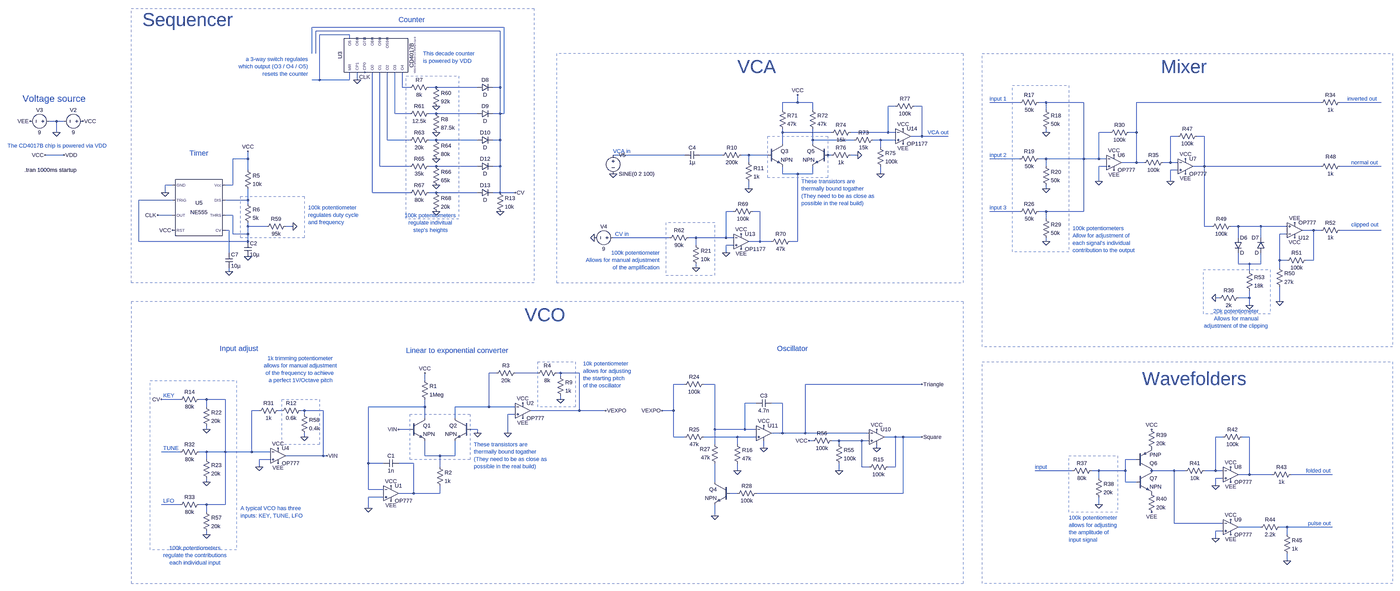
[diagram p0: schematic Full Simulation.asc, whole sheet]
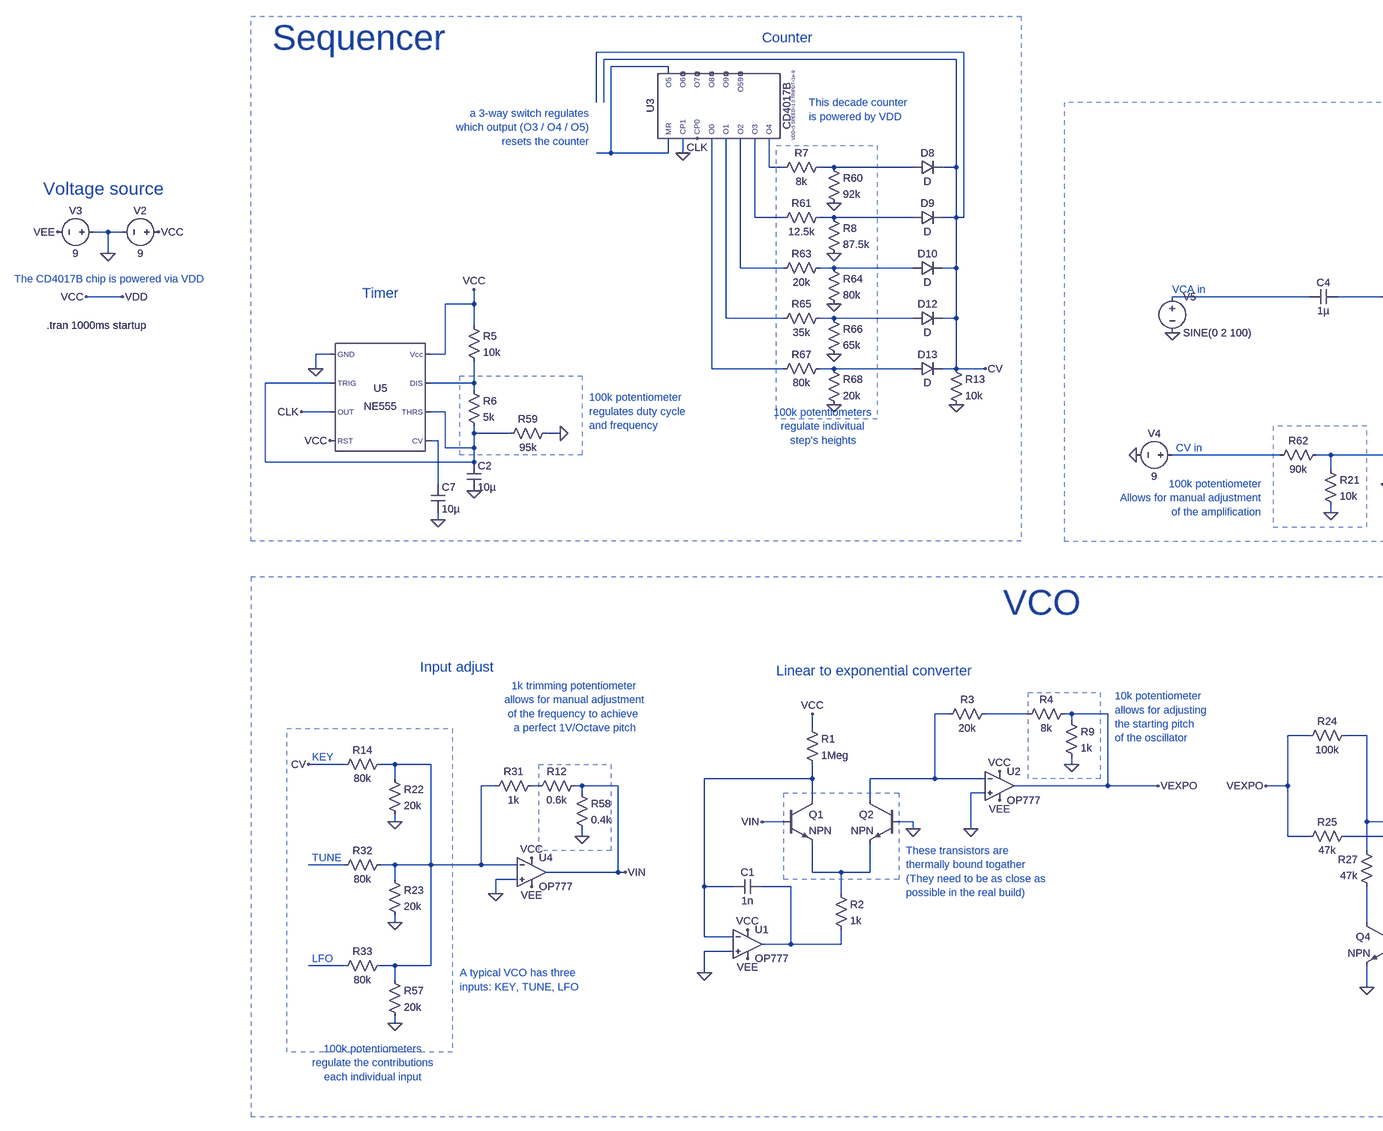
[diagram p1: schematic Full Simulation.asc, part, row 1 of 1, column 1 of 2]
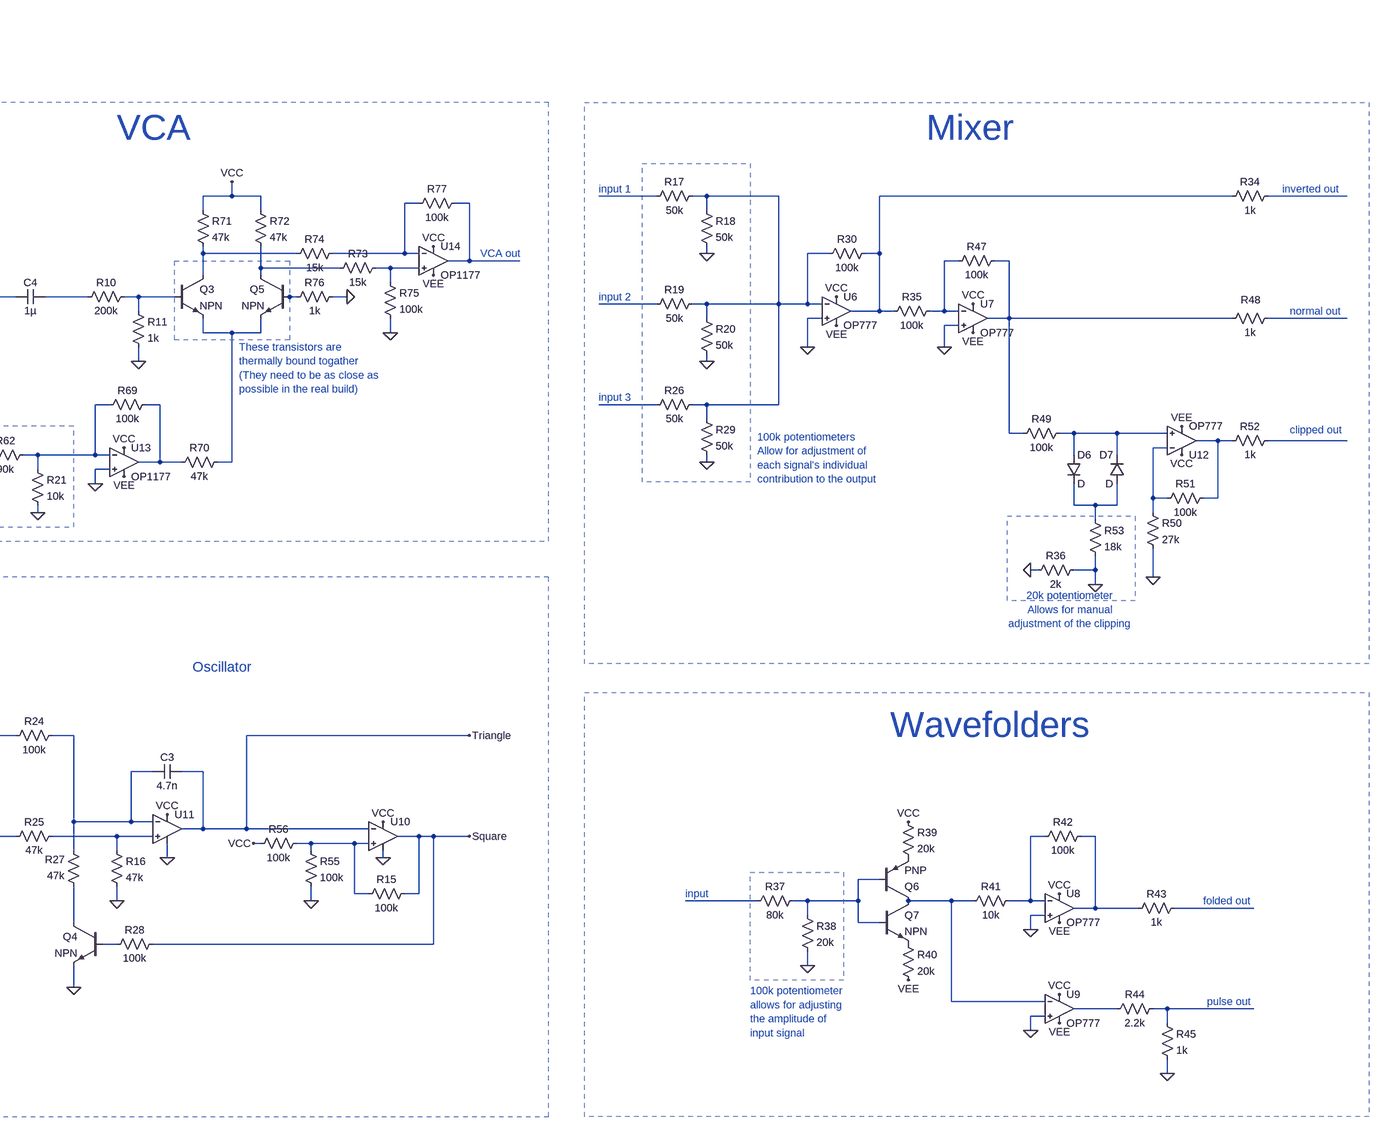
[diagram p2: schematic Full Simulation.asc, part, row 1 of 1, column 2 of 2]
Full Simulation.asc, the LTspice schematic file:
Version 4.1
SHEET 1 4816 2180
WIRE -1136 -736 -1952 -736
WIRE -1152 -720 -1936 -720
WIRE -1792 -704 -1920 -704
WIRE -1792 -688 -1792 -704
WIRE -1952 -624 -1952 -736
WIRE -1936 -624 -1936 -720
WIRE -1920 -512 -1920 -704
WIRE -1920 -512 -1952 -512
WIRE -1792 -512 -1792 -544
WIRE -1792 -512 -1920 -512
WIRE -1760 -512 -1760 -544
WIRE -1568 -480 -1568 -544
WIRE -1536 -480 -1568 -480
WIRE -1424 -480 -1456 -480
WIRE -1248 -480 -1424 -480
WIRE -1152 -480 -1152 -720
WIRE -1152 -480 -1184 -480
WIRE 112 -416 112 -448
WIRE 112 -416 48 -416
WIRE 176 -416 112 -416
WIRE 1056 -416 928 -416
WIRE 1168 -416 1136 -416
WIRE 1328 -416 1168 -416
WIRE 2336 -416 1552 -416
WIRE 2592 -416 2416 -416
WIRE 528 -400 496 -400
WIRE 640 -400 608 -400
WIRE 48 -384 48 -416
WIRE 176 -384 176 -416
WIRE 1168 -384 1168 -416
WIRE -1600 -368 -1600 -544
WIRE -1536 -368 -1600 -368
WIRE -1424 -368 -1456 -368
WIRE -1248 -368 -1424 -368
WIRE -1152 -368 -1152 -480
WIRE -1152 -368 -1184 -368
WIRE -1136 -368 -1136 -736
WIRE -1136 -368 -1152 -368
WIRE -3376 -336 -3408 -336
WIRE -3344 -336 -3376 -336
WIRE -3376 -288 -3376 -336
WIRE 48 -288 48 -304
WIRE 256 -288 48 -288
WIRE 496 -288 496 -400
WIRE 496 -288 336 -288
WIRE 528 -288 496 -288
WIRE 1168 -288 1168 -304
WIRE 1440 -288 1392 -288
WIRE 1552 -288 1552 -416
WIRE 1552 -288 1520 -288
WIRE 640 -272 640 -400
WIRE 640 -272 592 -272
WIRE 752 -272 640 -272
WIRE 1728 -272 1696 -272
WIRE 1840 -272 1808 -272
WIRE -1632 -256 -1632 -544
WIRE -1536 -256 -1632 -256
WIRE -1424 -256 -1456 -256
WIRE -1248 -256 -1424 -256
WIRE -1152 -256 -1152 -368
WIRE -1152 -256 -1184 -256
WIRE 176 -256 176 -304
WIRE 352 -256 176 -256
WIRE 464 -256 432 -256
WIRE 528 -256 464 -256
WIRE 48 -240 48 -288
WIRE 176 -240 176 -256
WIRE 464 -224 464 -256
WIRE -3344 -192 -3424 -192
WIRE -368 -192 -672 -192
WIRE -208 -192 -304 -192
WIRE -96 -192 -128 -192
WIRE -16 -192 -96 -192
WIRE 240 -192 224 -192
WIRE 256 -192 240 -192
WIRE 368 -192 336 -192
WIRE -2224 -176 -2224 -208
WIRE -2224 -176 -2288 -176
WIRE 1056 -176 928 -176
WIRE 1168 -176 1136 -176
WIRE 1328 -176 1328 -416
WIRE 1328 -176 1168 -176
WIRE 1392 -176 1392 -288
WIRE 1392 -176 1328 -176
WIRE 1424 -176 1392 -176
WIRE -96 -160 -96 -192
WIRE 1552 -160 1552 -288
WIRE 1552 -160 1488 -160
WIRE 1584 -160 1552 -160
WIRE 1696 -160 1696 -272
WIRE 1696 -160 1664 -160
WIRE 1728 -160 1696 -160
WIRE -1664 -144 -1664 -544
WIRE -1536 -144 -1664 -144
WIRE -1424 -144 -1456 -144
WIRE -1248 -144 -1424 -144
WIRE -1152 -144 -1152 -256
WIRE -1152 -144 -1184 -144
WIRE 1168 -144 1168 -176
WIRE 1424 -144 1392 -144
WIRE 1840 -144 1840 -272
WIRE 1840 -144 1792 -144
WIRE 2336 -144 1840 -144
WIRE 2592 -144 2416 -144
WIRE -2224 -128 -2224 -176
WIRE 1728 -128 1696 -128
WIRE 48 -112 48 -144
WIRE 112 -112 48 -112
WIRE 176 -112 176 -144
WIRE 176 -112 112 -112
WIRE 464 -112 464 -144
WIRE 1392 -80 1392 -144
WIRE 1696 -80 1696 -128
WIRE -2544 -64 -2576 -64
WIRE -2288 -64 -2288 -176
WIRE -2288 -64 -2320 -64
WIRE -96 -48 -96 -80
WIRE 1168 -48 1168 -64
WIRE -2576 -32 -2576 -64
WIRE -1696 -32 -1696 -544
WIRE -1536 -32 -1696 -32
WIRE -1424 -32 -1456 -32
WIRE -1248 -32 -1424 -32
WIRE -1152 -32 -1152 -144
WIRE -1152 -32 -1184 -32
WIRE -1088 -32 -1152 -32
WIRE -2544 0 -2688 0
WIRE -2224 0 -2224 -48
WIRE -2224 0 -2320 0
WIRE -2224 16 -2224 0
WIRE -160 48 -192 48
WIRE -48 48 -80 48
WIRE 1056 48 928 48
WIRE 1168 48 1136 48
WIRE 1328 48 1328 -176
WIRE 1328 48 1168 48
WIRE -2544 64 -2608 64
WIRE -2288 64 -2320 64
WIRE 1168 80 1168 48
WIRE -2224 112 -2224 96
WIRE -2144 112 -2224 112
WIRE -2032 112 -2064 112
WIRE 1840 112 1840 -144
WIRE 1872 112 1840 112
WIRE 1984 112 1952 112
WIRE 2080 112 1984 112
WIRE 2192 112 2080 112
WIRE -2304 128 -2320 128
WIRE 2304 128 2256 128
WIRE 2336 128 2304 128
WIRE 2592 128 2416 128
WIRE -2288 144 -2288 64
WIRE -2224 144 -2224 112
WIRE -2224 144 -2288 144
WIRE 2192 144 2160 144
WIRE -432 160 -672 160
WIRE -320 160 -352 160
WIRE -192 160 -192 48
WIRE -192 160 -320 160
WIRE -160 160 -192 160
WIRE 1984 160 1984 112
WIRE 2080 160 2080 112
WIRE -2688 176 -2688 0
WIRE -2224 176 -2224 144
WIRE -2224 176 -2688 176
WIRE -48 176 -48 48
WIRE -48 176 -96 176
WIRE 0 176 -48 176
WIRE 112 176 112 -112
WIRE 112 176 80 176
WIRE 1168 176 1168 160
WIRE -320 192 -320 160
WIRE -160 192 -192 192
WIRE -2304 224 -2304 128
WIRE -192 224 -192 192
WIRE 2160 256 2160 144
WIRE 2192 256 2160 256
WIRE 2304 256 2304 128
WIRE 2304 256 2272 256
WIRE 1984 272 1984 224
WIRE 2032 272 1984 272
WIRE 2080 272 2080 224
WIRE 2080 272 2032 272
WIRE -320 288 -320 272
WIRE 2160 288 2160 256
WIRE -2304 304 -2304 288
WIRE 2032 304 2032 272
WIRE 1904 416 1888 416
WIRE 2032 416 2032 384
WIRE 2032 416 1984 416
WIRE 2160 432 2160 368
WIRE 2032 448 2032 416
WIRE -1168 736 -1200 736
WIRE -992 736 -1088 736
WIRE -896 736 -912 736
WIRE -816 736 -896 736
WIRE -896 752 -896 736
WIRE -1472 768 -1472 736
WIRE -368 784 -416 784
WIRE -240 784 -288 784
WIRE 640 784 144 784
WIRE -2512 848 -2592 848
WIRE -2400 848 -2432 848
WIRE -2320 848 -2400 848
WIRE -896 848 -896 832
WIRE -64 864 -112 864
WIRE 48 864 0 864
WIRE -2400 880 -2400 848
WIRE -1472 880 -1472 848
WIRE -1472 880 -1712 880
WIRE -1200 880 -1200 736
WIRE -1200 880 -1344 880
WIRE -1088 880 -1200 880
WIRE -2176 896 -2208 896
WIRE -2080 896 -2096 896
WIRE -1984 896 -2000 896
WIRE -1904 896 -1984 896
WIRE -816 896 -816 736
WIRE -816 896 -1024 896
WIRE -704 896 -816 896
WIRE -416 896 -416 784
WIRE -416 896 -464 896
WIRE -1984 912 -1984 896
WIRE -1088 912 -1120 912
WIRE -1472 928 -1472 880
WIRE -1344 928 -1344 880
WIRE -2400 976 -2400 960
WIRE -1536 976 -1584 976
WIRE -1248 976 -1280 976
WIRE -240 976 -240 784
WIRE -112 976 -112 864
WIRE -112 976 -240 976
WIRE -64 976 -112 976
WIRE -1248 992 -1248 976
WIRE -1120 992 -1120 912
WIRE 48 992 48 864
WIRE 48 992 0 992
WIRE 144 992 144 784
WIRE 144 992 48 992
WIRE 416 992 144 992
WIRE -1984 1008 -1984 992
WIRE -416 1008 -416 896
WIRE -368 1008 -416 1008
WIRE -144 1008 -288 1008
WIRE -64 1008 -144 1008
WIRE 528 1008 480 1008
WIRE 560 1008 528 1008
WIRE 640 1008 560 1008
WIRE 1920 1008 1888 1008
WIRE 2032 1008 2000 1008
WIRE 176 1024 160 1024
WIRE 288 1024 256 1024
WIRE 384 1024 288 1024
WIRE 416 1024 384 1024
WIRE -240 1040 -240 976
WIRE -144 1040 -144 1008
WIRE 288 1040 288 1024
WIRE -32 1056 -32 1024
WIRE 448 1056 448 1040
WIRE -2512 1072 -2592 1072
WIRE -2400 1072 -2432 1072
WIRE -2320 1072 -2320 848
WIRE -2320 1072 -2400 1072
WIRE -2208 1072 -2208 896
WIRE -2208 1072 -2320 1072
WIRE -2128 1072 -2208 1072
WIRE -1904 1088 -1904 896
WIRE -1904 1088 -2064 1088
WIRE -1888 1088 -1904 1088
WIRE -1472 1088 -1472 1024
WIRE -1408 1088 -1472 1088
WIRE -1344 1088 -1344 1024
WIRE -1344 1088 -1408 1088
WIRE -2400 1104 -2400 1072
WIRE -2128 1104 -2176 1104
WIRE 1552 1104 1504 1104
WIRE -1712 1120 -1712 880
WIRE -1648 1120 -1712 1120
WIRE -1520 1120 -1584 1120
WIRE -2176 1136 -2176 1104
WIRE -1408 1136 -1408 1088
WIRE 384 1136 384 1024
WIRE 416 1136 384 1136
WIRE 528 1136 528 1008
WIRE 528 1136 496 1136
WIRE -144 1152 -144 1120
WIRE 288 1152 288 1120
WIRE 1280 1152 1120 1152
WIRE 1392 1152 1360 1152
WIRE 1504 1152 1504 1104
WIRE 1504 1152 1392 1152
WIRE 1712 1152 1616 1152
WIRE 1760 1152 1712 1152
WIRE 1888 1152 1888 1008
WIRE 1888 1152 1840 1152
WIRE 1920 1152 1888 1152
WIRE 2032 1168 2032 1008
WIRE 2032 1168 1984 1168
WIRE 2128 1168 2032 1168
WIRE 2384 1168 2208 1168
WIRE 1392 1184 1392 1152
WIRE 1920 1184 1888 1184
WIRE -2400 1200 -2400 1184
WIRE -240 1200 -240 1120
WIRE 1504 1200 1504 1152
WIRE 1552 1200 1504 1200
WIRE 1888 1216 1888 1184
WIRE -1712 1232 -1712 1120
WIRE -1648 1232 -1712 1232
WIRE -1520 1248 -1520 1120
WIRE -1520 1248 -1584 1248
WIRE -1408 1248 -1408 1216
WIRE -1408 1248 -1520 1248
WIRE -144 1248 -176 1248
WIRE 560 1248 560 1008
WIRE 560 1248 -64 1248
WIRE -1648 1264 -1712 1264
WIRE -2512 1296 -2592 1296
WIRE -2400 1296 -2432 1296
WIRE -2320 1296 -2320 1072
WIRE -2320 1296 -2400 1296
WIRE 1392 1296 1392 1264
WIRE -1712 1312 -1712 1264
WIRE -2400 1328 -2400 1296
WIRE -240 1344 -240 1296
WIRE 1712 1376 1712 1152
WIRE 1920 1376 1712 1376
WIRE 2080 1392 1984 1392
WIRE 2192 1392 2160 1392
WIRE 2384 1392 2192 1392
WIRE 1920 1408 1888 1408
WIRE -2400 1424 -2400 1408
WIRE 2192 1424 2192 1392
WIRE 1888 1440 1888 1408
WIRE 2192 1536 2192 1504
FLAG -1712 1312 0
FLAG -704 896 VEXPO
FLAG -2224 240 0
FLAG -2608 64 CLK
FLAG -2576 -32 0
FLAG -3488 -336 VEE
FLAG -3264 -336 VCC
FLAG -1472 736 VCC
FLAG -1056 864 VCC
FLAG -1056 928 VEE
FLAG -1728 -544 CLK
FLAG -1760 -512 0
FLAG -1088 -32 CV
FLAG -1152 48 0
FLAG -1616 1216 VCC
FLAG -1616 1280 VEE
FLAG -2176 1136 0
FLAG -1888 1088 VIN
FLAG -2096 1056 VCC
FLAG -2096 1120 VEE
FLAG -1584 976 VIN
FLAG -2592 848 CV
FLAG -464 896 VEXPO
FLAG -3376 -288 0
FLAG -1248 992 0
FLAG -1120 992 0
FLAG 448 976 VCC
FLAG -32 960 VCC
FLAG -240 1344 0
FLAG 448 1056 0
FLAG -32 1056 0
FLAG -144 1152 0
FLAG 640 784 Triangle
FLAG 640 1008 Square
FLAG -2304 304 0
FLAG 1168 -288 0
FLAG 1168 -48 0
FLAG 1168 176 0
FLAG 1392 -80 0
FLAG 1696 -80 0
FLAG 2160 432 0
FLAG 1456 -192 VCC
FLAG 1760 -176 VCC
FLAG 2224 160 VCC
FLAG 2224 96 VEE
FLAG 1456 -128 VEE
FLAG 1760 -112 VEE
FLAG -2224 -208 VCC
FLAG -2544 128 VCC
FLAG -3424 -192 VCC
FLAG -3344 -192 VDD
FLAG 288 1152 0
FLAG 160 1024 VCC
FLAG -2400 976 0
FLAG -2400 1200 0
FLAG -2400 1424 0
FLAG -1984 1008 0
FLAG -2032 112 0
FLAG -1424 -288 0
FLAG -1424 -400 0
FLAG -1424 -176 0
FLAG -1424 -64 0
FLAG -1424 48 0
FLAG -896 848 0
FLAG -96 -48 0
FLAG -192 224 0
FLAG -128 144 VCC
FLAG -128 208 VEE
FLAG 112 -448 VCC
FLAG 464 -112 0
FLAG 368 -192 0
FLAG 560 -240 VEE
FLAG 560 -304 VCC
FLAG -320 288 0
FLAG 1888 416 0
FLAG 2032 448 0
FLAG 1392 1296 0
FLAG 1616 976 VCC
FLAG 1616 1328 VEE
FLAG 1952 1136 VCC
FLAG 1952 1200 VEE
FLAG 1888 1216 0
FLAG 1952 1360 VCC
FLAG 1952 1424 VEE
FLAG 1888 1440 0
FLAG 2192 1536 0
FLAG -752 160 0
FLAG -672 -112 0
SYMBOL res -1488 752 R0
SYMATTR InstName R1
SYMATTR Value 1Meg
SYMBOL npn -1536 928 R0
SYMATTR InstName Q1
SYMBOL npn -1280 928 M0
SYMATTR InstName Q2
SYMBOL res -1424 1120 R0
SYMATTR InstName R2
SYMATTR Value 1k
SYMBOL cap -1584 1104 R90
WINDOW 0 0 32 VBottom 2
WINDOW 3 32 32 VTop 2
SYMATTR InstName C1
SYMATTR Value 1n
SYMBOL OpAmps\\OP777 -1056 832 R0
SYMATTR InstName U2
SYMBOL res -1072 720 R90
WINDOW 0 0 56 VBottom 2
WINDOW 3 32 56 VTop 2
SYMATTR InstName R3
SYMATTR Value 20k
SYMBOL res -896 720 R90
WINDOW 0 0 56 VBottom 2
WINDOW 3 32 56 VTop 2
SYMATTR InstName R4
SYMATTR Value 8k
SYMBOL Misc\\NE555 -2432 32 R0
SYMATTR InstName U5
SYMBOL res -2240 -144 R0
SYMATTR InstName R5
SYMATTR Value 10k
SYMBOL res -2240 0 R0
SYMATTR InstName R6
SYMATTR Value 5k
SYMBOL cap -2240 176 R0
SYMATTR InstName C2
SYMATTR Value 10µ
SYMBOL voltage -3248 -336 R90
WINDOW 0 -32 56 VBottom 2
WINDOW 3 32 56 VTop 2
SYMATTR InstName V2
SYMATTR Value 9
SYMBOL voltage -3392 -336 R90
WINDOW 0 -32 56 VBottom 2
WINDOW 3 32 56 VTop 2
SYMATTR InstName V3
SYMATTR Value 9
SYMBOL CD4017B -1680 -608 R270
WINDOW 39 8 160 Top 0
SYMATTR InstName U3
SYMBOL res -1440 -496 R90
WINDOW 0 0 56 VBottom 2
WINDOW 3 32 56 VTop 2
SYMATTR InstName R7
SYMATTR Value 8k
SYMBOL res -1168 -48 R0
SYMATTR InstName R13
SYMATTR Value 10k
SYMBOL OpAmps\\OP777 -1616 1184 R0
SYMATTR InstName U1
SYMBOL OpAmps\\OP777 -2096 1024 R0
SYMATTR InstName U4
SYMBOL res -1984 880 R90
WINDOW 0 0 56 VBottom 2
WINDOW 3 32 56 VTop 2
SYMATTR InstName R12
SYMATTR Value 0.6k
SYMBOL res -2416 832 R90
WINDOW 0 0 56 VBottom 2
WINDOW 3 32 56 VTop 2
SYMATTR InstName R14
SYMATTR Value 80k
SYMBOL res -272 768 R90
WINDOW 0 0 56 VBottom 2
WINDOW 3 32 56 VTop 2
SYMATTR InstName R24
SYMATTR Value 100k
SYMBOL res -272 992 R90
WINDOW 0 0 56 VBottom 2
WINDOW 3 32 56 VTop 2
SYMATTR InstName R25
SYMATTR Value 47k
SYMBOL res -224 1136 R180
WINDOW 0 36 76 Left 2
WINDOW 3 36 40 Left 2
SYMATTR InstName R27
SYMATTR Value 47k
SYMBOL res -48 1232 R90
WINDOW 0 0 56 VBottom 2
WINDOW 3 32 56 VTop 2
SYMATTR InstName R28
SYMATTR Value 100k
SYMBOL npn -176 1200 M0
SYMATTR InstName Q4
SYMBOL res 512 1120 R90
WINDOW 0 0 56 VBottom 2
WINDOW 3 32 56 VTop 2
SYMATTR InstName R15
SYMATTR Value 100k
SYMBOL res -160 1024 R0
SYMATTR InstName R16
SYMATTR Value 47k
SYMBOL cap -2320 224 R0
SYMATTR InstName C7
SYMATTR Value 10µ
SYMBOL Opamps\\UniversalOpamp2 448 1008 R0
SYMATTR InstName U10
SYMBOL Opamps\\UniversalOpamp2 -32 992 R0
SYMATTR InstName U11
SYMBOL res -2080 880 R90
WINDOW 0 0 56 VBottom 2
WINDOW 3 32 56 VTop 2
SYMATTR InstName R31
SYMATTR Value 1k
SYMBOL res -2416 1280 R90
WINDOW 0 0 56 VBottom 2
WINDOW 3 32 56 VTop 2
SYMATTR InstName R33
SYMATTR Value 80k
SYMBOL cap 0 848 R90
WINDOW 0 0 32 VBottom 2
WINDOW 3 32 32 VTop 2
SYMATTR InstName C3
SYMATTR Value 4.7n
SYMBOL res -2416 1056 R90
WINDOW 0 0 56 VBottom 2
WINDOW 3 32 56 VTop 2
SYMATTR InstName R32
SYMATTR Value 80k
SYMBOL Res 1152 -432 R90
WINDOW 0 0 56 VBottom 2
WINDOW 3 32 56 VTop 2
SYMATTR InstName R17
SYMATTR Value 50k
SYMBOL Res 1152 -400 R0
SYMATTR InstName R18
SYMATTR Value 50k
SYMBOL Res 1040 -160 R270
WINDOW 0 32 56 VTop 2
WINDOW 3 0 56 VBottom 2
SYMATTR InstName R19
SYMATTR Value 50k
SYMBOL Res 1152 32 R90
WINDOW 0 0 56 VBottom 2
WINDOW 3 32 56 VTop 2
SYMATTR InstName R26
SYMATTR Value 50k
SYMBOL Res 1152 64 R0
SYMATTR InstName R29
SYMATTR Value 50k
SYMBOL Res 1536 -304 R90
WINDOW 0 0 56 VBottom 2
WINDOW 3 32 56 VTop 2
SYMATTR InstName R30
SYMATTR Value 100k
SYMBOL Res 2432 -432 R90
WINDOW 0 0 56 VBottom 2
WINDOW 3 32 56 VTop 2
SYMATTR InstName R34
SYMATTR Value 1k
SYMBOL Res 1680 -176 R90
WINDOW 0 0 56 VBottom 2
WINDOW 3 32 56 VTop 2
SYMATTR InstName R35
SYMATTR Value 100k
SYMBOL Res 1824 -288 R90
WINDOW 0 0 56 VBottom 2
WINDOW 3 32 56 VTop 2
SYMATTR InstName R47
SYMATTR Value 100k
SYMBOL Res 2432 -160 R90
WINDOW 0 -9 55 VBottom 2
WINDOW 3 32 56 VTop 2
SYMATTR InstName R48
SYMATTR Value 1k
SYMBOL Res 1968 96 R90
WINDOW 0 0 56 VBottom 2
WINDOW 3 32 56 VTop 2
SYMATTR InstName R49
SYMATTR Value 100k
SYMBOL Diode 1968 160 R0
SYMATTR InstName D6
SYMBOL Diode 2096 224 R180
WINDOW 0 24 64 Left 2
WINDOW 3 24 0 Left 2
SYMATTR InstName D7
SYMBOL Res 2144 272 R0
SYMATTR InstName R50
SYMATTR Value 27k
SYMBOL Res 2288 240 R90
WINDOW 0 0 56 VBottom 2
WINDOW 3 32 56 VTop 2
SYMATTR InstName R51
SYMATTR Value 100k
SYMBOL Res 2432 112 R90
WINDOW 0 0 56 VBottom 2
WINDOW 3 32 56 VTop 2
SYMATTR InstName R52
SYMATTR Value 1k
SYMBOL Res 2016 288 R0
SYMATTR InstName R53
SYMATTR Value 18k
SYMBOL OpAmps/OP777 1456 -224 R0
SYMATTR InstName U6
SYMBOL OpAmps/OP777 1760 -208 R0
SYMATTR InstName U7
SYMBOL OpAmps/OP777 2224 192 M180
SYMATTR InstName U12
SYMBOL res 272 1024 R0
SYMATTR InstName R55
SYMATTR Value 100k
SYMBOL res 272 1008 R90
WINDOW 0 0 56 VBottom 2
WINDOW 3 32 56 VTop 2
SYMATTR InstName R56
SYMATTR Value 100k
SYMBOL res -2416 864 R0
SYMATTR InstName R22
SYMATTR Value 20k
SYMBOL res -2416 1088 R0
SYMATTR InstName R23
SYMATTR Value 20k
SYMBOL res -2416 1312 R0
SYMATTR InstName R57
SYMATTR Value 20k
SYMBOL res -2000 896 R0
SYMATTR InstName R58
SYMATTR Value 0.4k
SYMBOL res -2048 96 R90
WINDOW 0 0 56 VBottom 2
WINDOW 3 32 56 VTop 2
SYMATTR InstName R59
SYMATTR Value 95k
SYMBOL res -1440 -496 R0
SYMATTR InstName R60
SYMATTR Value 92k
SYMBOL diode -1248 -464 R270
WINDOW 0 32 32 VTop 2
WINDOW 3 0 32 VBottom 2
SYMATTR InstName D8
SYMBOL res -1440 -384 R90
WINDOW 0 0 56 VBottom 2
WINDOW 3 32 56 VTop 2
SYMATTR InstName R61
SYMATTR Value 12.5k
SYMBOL res -1440 -272 R90
WINDOW 0 0 56 VBottom 2
WINDOW 3 32 56 VTop 2
SYMATTR InstName R63
SYMATTR Value 20k
SYMBOL res -1440 -272 R0
SYMATTR InstName R64
SYMATTR Value 80k
SYMBOL res -1440 -160 R90
WINDOW 0 0 56 VBottom 2
WINDOW 3 32 56 VTop 2
SYMATTR InstName R65
SYMATTR Value 35k
SYMBOL res -1440 -160 R0
SYMATTR InstName R66
SYMATTR Value 65k
SYMBOL res -1440 -48 R90
WINDOW 0 0 56 VBottom 2
WINDOW 3 32 56 VTop 2
SYMATTR InstName R67
SYMATTR Value 80k
SYMBOL res -1440 -48 R0
SYMATTR InstName R68
SYMATTR Value 20k
SYMBOL diode -1248 -352 R270
WINDOW 0 32 32 VTop 2
WINDOW 3 0 32 VBottom 2
SYMATTR InstName D9
SYMBOL diode -1248 -240 R270
WINDOW 0 32 32 VTop 2
WINDOW 3 0 32 VBottom 2
SYMATTR InstName D10
SYMBOL diode -1248 -128 R270
WINDOW 0 32 32 VTop 2
WINDOW 3 0 32 VBottom 2
SYMATTR InstName D12
SYMBOL diode -1248 -16 R270
WINDOW 0 32 32 VTop 2
WINDOW 3 0 32 VBottom 2
SYMATTR InstName D13
SYMBOL res -1440 -384 R0
SYMATTR InstName R8
SYMATTR Value 87.5k
SYMBOL res -912 736 R0
SYMATTR InstName R9
SYMATTR Value 1k
SYMBOL cap -304 -208 R90
WINDOW 0 0 32 VBottom 2
WINDOW 3 32 32 VTop 2
SYMATTR InstName C4
SYMATTR Value 1µ
SYMBOL res -112 -208 R90
WINDOW 0 0 56 VBottom 2
WINDOW 3 32 56 VTop 2
SYMATTR InstName R10
SYMATTR Value 200k
SYMBOL res -112 -176 R0
SYMATTR InstName R11
SYMATTR Value 1k
SYMBOL npn -16 -240 R0
SYMATTR InstName Q3
SYMBOL npn 240 -240 M0
SYMATTR InstName Q5
SYMBOL res -336 144 R90
WINDOW 0 0 56 VBottom 2
WINDOW 3 32 56 VTop 2
SYMATTR InstName R62
SYMATTR Value 90k
SYMBOL OpAmps\\OP1177 -128 112 R0
SYMATTR InstName U13
SYMBOL res -64 32 R90
WINDOW 0 0 56 VBottom 2
WINDOW 3 32 56 VTop 2
SYMATTR InstName R69
SYMATTR Value 100k
SYMBOL res 96 160 R90
WINDOW 0 0 56 VBottom 2
WINDOW 3 32 56 VTop 2
SYMATTR InstName R70
SYMATTR Value 47k
SYMBOL res 32 -400 R0
SYMATTR InstName R71
SYMATTR Value 47k
SYMBOL res 160 -400 R0
SYMATTR InstName R72
SYMATTR Value 47k
SYMBOL res 448 -272 R90
WINDOW 0 0 56 VBottom 2
WINDOW 3 32 56 VTop 2
SYMATTR InstName R73
SYMATTR Value 15k
SYMBOL res 352 -304 R90
WINDOW 0 0 56 VBottom 2
WINDOW 3 32 56 VTop 2
SYMATTR InstName R74
SYMATTR Value 15k
SYMBOL res 448 -240 R0
SYMATTR InstName R75
SYMATTR Value 100k
SYMBOL OpAmps\\OP1177 560 -336 R0
SYMATTR InstName U14
SYMBOL res 240 -176 R270
WINDOW 0 32 56 VTop 2
WINDOW 3 0 56 VBottom 2
SYMATTR InstName R76
SYMATTR Value 1k
SYMBOL res 624 -416 R90
WINDOW 0 0 56 VBottom 2
WINDOW 3 32 56 VTop 2
SYMATTR InstName R77
SYMATTR Value 100k
SYMBOL res -336 176 R0
SYMATTR InstName R21
SYMATTR Value 10k
SYMBOL res 1152 -160 R0
SYMATTR InstName R20
SYMATTR Value 50k
SYMBOL res 2000 400 R90
WINDOW 0 0 56 VBottom 2
WINDOW 3 32 56 VTop 2
SYMATTR InstName R36
SYMATTR Value 2k
SYMBOL res 1376 1136 R90
WINDOW 0 0 56 VBottom 2
WINDOW 3 32 56 VTop 2
SYMATTR InstName R37
SYMATTR Value 80k
SYMBOL res 1376 1168 R0
SYMATTR InstName R38
SYMATTR Value 20k
SYMBOL pnp 1552 1152 M180
SYMATTR InstName Q6
SYMBOL npn 1552 1152 R0
SYMATTR InstName Q7
SYMBOL res 1600 960 R0
SYMATTR InstName R39
SYMATTR Value 20k
SYMBOL res 1600 1232 R0
SYMATTR InstName R40
SYMATTR Value 20k
SYMBOL res 1856 1136 R90
WINDOW 0 0 56 VBottom 2
WINDOW 3 32 56 VTop 2
SYMATTR InstName R41
SYMATTR Value 10k
SYMBOL res 2016 992 R90
WINDOW 0 0 56 VBottom 2
WINDOW 3 32 56 VTop 2
SYMATTR InstName R42
SYMATTR Value 100k
SYMBOL OpAmps/OP777 1952 1104 R0
SYMATTR InstName U8
SYMBOL res 2224 1152 R90
WINDOW 0 0 56 VBottom 2
WINDOW 3 32 56 VTop 2
SYMATTR InstName R43
SYMATTR Value 1k
SYMBOL OpAmps/OP777 1952 1328 R0
SYMATTR InstName U9
SYMBOL res 2176 1376 R90
WINDOW 0 0 56 VBottom 2
WINDOW 3 32 56 VTop 2
SYMATTR InstName R44
SYMATTR Value 2.2k
SYMBOL res 2176 1408 R0
SYMATTR InstName R45
SYMATTR Value 1k
SYMBOL voltage -656 160 R90
WINDOW 0 -32 56 VBottom 2
WINDOW 3 32 56 VTop 2
SYMATTR InstName V4
SYMATTR Value 9
SYMBOL voltage -672 -208 R0
WINDOW 123 0 0 Left 0
WINDOW 39 0 0 Left 0
SYMATTR InstName V5
SYMATTR Value SINE(0 2 100)
TEXT -3512 -128 Left 2 !.tran 1000ms startup
TEXT -1480 -624 Left 2 ;This decade counter\nis powered by VDD
TEXT -1968 -600 Right 2 ;a 3-way switch regulates\nwhich output (O3 / O4 / O5)\nresets the counter
TEXT -2672 -768 Left 6 ;Sequencer
TEXT -3520 -432 Left 4 ;Voltage source
TEXT -2344 632 Left 3 ;Input adjust
TEXT -800 696 Left 2 ;10k potentiometer\nallows for adjusting\nthe starting pitch\nof the oscillator
TEXT -1552 640 Left 3 ;Linear to exponential converter
TEXT 24 632 Left 3 ;Oscillator
TEXT -144 -568 Left 6 ;VCA
TEXT -1968 32 Left 2 ;100k potentiometer\nregulates duty cycle\nand frequency
TEXT -1448 96 Center 2 ;100k potentiometers\nregulate indivitual\nstep's heights
TEXT -2000 720 Center 2 ;1k trimming potentiometer\nallows for manual adjustment\nof the frequency to achieve \na perfect 1V/Octave pitch
TEXT 1280 120 Left 2 ;100k potentiometers\nAllow for adjustment of\neach signal's individual\ncontribution to the output
TEXT 1976 504 Center 2 ;20k potentiometer\nAllows for manual\nadjustment of the clipping
TEXT -3584 -232 Left 2 ;The CD4017B chip is powered via VDD
TEXT -2448 1512 Center 2 ;100k potentiometers\nregulate the contributions\neach individual input
TEXT -2256 1312 Left 2 ;A typical VCO has three\ninputs: KEY, TUNE, LFO
TEXT -2472 -200 Left 3 ;Timer
TEXT -1584 -768 Left 3 ;Counter
TEXT -1048 488 Left 6 ;VCO
TEXT -1264 1040 Left 2 ;These transistors are\nthermally bound togather\n(They need to be as close as\npossible in the real build)
TEXT 128 -80 Left 2 ;These transistors are\nthermally bound togather\n(They need to be as close as\npossible in the real build)
TEXT -472 224 Right 2 ;100k potentiometer\nAllows for manual adjustment\nof the amplification
TEXT 2448 -432 Left 2 ;inverted out
TEXT 2464 -160 Left 2 ;normal out
TEXT 2464 104 Left 2 ;clipped out
TEXT 1656 -568 Left 6 ;Mixer
TEXT -672 -208 Left 2 ;VCA in
TEXT 664 -288 Left 2 ;VCA out
TEXT -664 144 Left 2 ;CV in
TEXT -2584 832 Left 2 ;KEY
TEXT -2584 1056 Left 2 ;TUNE
TEXT -2584 1280 Left 2 ;LFO
TEXT 928 -432 Left 2 ;input 1
TEXT 928 -192 Left 2 ;input 2
TEXT 928 32 Left 2 ;input 3
TEXT 2280 1376 Left 2 ;pulse out
TEXT 2272 1152 Left 2 ;folded out
TEXT 1120 1136 Left 2 ;input
TEXT 1264 1352 Left 2 ;100k potentiometer\nallows for adjusting\nthe amplitude of\ninput signal
TEXT 1576 760 Left 6 ;Wavefolders
RECTANGLE Normal 1836 296 2120 484 2
RECTANGLE Normal 1024 -488 1264 220 2
RECTANGLE Normal -2272 1488 -2640 768 2
RECTANGLE Normal -2080 848 -1920 1040 2
RECTANGLE Normal -2720 -816 -1008 352 2
RECTANGLE Normal -1984 160 -2256 -16 2
RECTANGLE Normal -1552 -528 -1328 80 2
RECTANGLE Normal 816 432 -2720 1632 2
RECTANGLE Normal -1280 1104 -1536 912 2
RECTANGLE Normal -992 688 -832 880 2
RECTANGLE Normal 816 -624 -912 352 2
RECTANGLE Normal 240 -96 -16 -272 2
RECTANGLE Normal -448 320 -240 96 2
RECTANGLE Normal 2640 624 896 -624 2
RECTANGLE Normal 2640 1632 896 688 2
RECTANGLE Normal 1472 1328 1264 1088 2

The netlist it stands for:
* Full Simulation.asc
R1 VDD N046 1Meg
Q1 N046 VIN N053 0 NPN
Q2 N042 0 N053 0 NPN
R2 N053 N055 1k
C1 N055 N046 1n
X§U2 0 N042 VDD VEE VEXPO OP777  ; pins In+ In- V+ V- OUT
R3 N043 N042 20k
R4 VEXPO N043 8k
X§U5 0 N030 CLK VDD N036 N030 N031 VDD NE555  ; pins GND TRIG OUT RST CV THRS DIS Vcc
R5 VDD N031 10k
R6 N031 N030 5k
C2 N030 0 10µ
V2 VDD 0 9
V3 0 VEE 9
X§U3 N001 0 CLK N028 N024 N015 N010 N002 N001 NC_01 NC_02 NC_03 NC_04 NC_05 VDD 0 CD4017B VDD=5 SPEED=1.0 TRIPDT=1e-9  ; pins MR CP1 CP0 O0 O1 O2 O3 O4 O5 O6 O7 O8 O9 O59
R7 N003 N002 8k
R13 CV 0 10k
X§U1 0 N046 VDD VEE N055 OP777  ; pins In+ In- V+ V- OUT
X§U4 0 N045 VDD VEE VIN OP777  ; pins In+ In- V+ V- OUT
R12 VIN N047 0.6k
R14 N045 CV 80k
R24 N044 VEXPO 100k
R25 N048 VEXPO 47k
R27 N059 N044 47k
R28 Square N060 100k
Q4 N059 N060 0 0 NPN
R15 Square N051 100k
R16 N048 0 47k
C7 N036 0 10µ
X§U10 N051 Triangle VDD 0 Square level.2 Avol=1Meg GBW=10Meg Slew=10Meg ilimit=25m rail=0 Vos=0 phimargin=45 en=0 enk=0 in=0 ink=0 Rin=500Meg  ; pins IN+ IN- V+ V- OUT
X§U11 N048 N044 VDD 0 Triangle level.2 Avol=1Meg GBW=10Meg Slew=10Meg ilimit=25m rail=0 Vos=0 phimargin=45 en=0 enk=0 in=0 ink=0 Rin=500Meg  ; pins IN+ IN- V+ V- OUT
R31 N047 N045 1k
R33 N045 N061 80k
C3 Triangle N044 4.7n
R32 N045 N052 80k
R17 N005 N004 50k
R18 N005 0 50k
R19 N023 N005 50k
R26 N005 N034 50k
R29 N005 0 50k
R30 N006 N005 100k
R34 N007 N006 1k
R35 N013 N006 100k
R47 N014 N013 100k
R48 N026 N014 1k
R49 N035 N014 100k
D6 N035 N041 D
D7 N041 N035 D
R50 N039 0 27k
R51 N037 N039 100k
R52 N038 N037 1k
R53 N041 0 18k
X§U6 0 N005 VDD VEE N006 OP777  ; pins In+ In- V+ V- OUT
X§U7 0 N013 VDD VEE N014 OP777  ; pins In+ In- V+ V- OUT
X§U12 N035 N039 VDD VEE N037 OP777  ; pins In+ In- V+ V- OUT
R55 N051 0 100k
R56 N051 VDD 100k
R22 N045 0 20k
R23 N045 0 20k
R57 N045 0 20k
R58 VIN 0 0.4k
R59 0 N030 95k
R60 N003 0 92k
D8 N003 CV D
R61 N011 N010 12.5k
R63 N016 N015 20k
R64 N016 0 80k
R65 N025 N024 35k
R66 N025 0 65k
R67 N029 N028 80k
R68 N029 0 20k
D9 N011 CV D
D10 N016 CV D
D12 N025 CV D
D13 N029 CV D
R8 N011 0 87.5k
R9 VEXPO 0 1k
C4 N020 N019 1µ
R10 N021 N020 200k
R11 N021 0 1k
Q3 N012 N021 N027 0 NPN
Q5 N017 N022 N027 0 NPN
R62 N032 N040 90k
X§U13 0 N032 VDD VEE N033 OP1177  ; pins In+ In- V+ V- OUT
R69 N033 N032 100k
R70 N027 N033 47k
R71 VDD N012 47k
R72 VDD N017 47k
R73 N018 N017 15k
R74 N008 N012 15k
R75 N018 0 100k
X§U14 N018 N008 VDD VEE N009 OP1177  ; pins In+ In- V+ V- OUT
R76 N022 0 1k
R77 N009 N008 100k
R21 N032 0 10k
R20 N005 0 50k
R36 0 0 2k
R37 N054 N056 80k
R38 N054 0 20k
Q6 N057 N054 P001 0 PNP
Q7 N057 N054 P002 0 NPN
R39 VDD P001 20k
R40 P002 VEE 20k
R41 N049 N057 10k
R42 N050 N049 100k
X§U8 0 N049 VDD VEE N050 OP777  ; pins In+ In- V+ V- OUT
R43 N058 N050 1k
X§U9 0 N057 VDD VEE N062 OP777  ; pins In+ In- V+ V- OUT
R44 N063 N062 2.2k
R45 N063 0 1k
V4 N040 0 9
V5 N019 0 SINE(0 2 100)
.model D D
.lib standard.dio
.model NPN NPN
.model PNP PNP
.lib standard.bjt
.tran 1000ms startup
* This decade counter
* is powered by VDD
* a 3-way switch regulates
* which output (O3 / O4 / O5)
* resets the counter
* Sequencer
* Voltage source
* Input adjust
* 10k potentiometer
* allows for adjusting
* the starting pitch
* of the oscillator
* Linear to exponential converter
* Oscillator
* VCA
* 100k potentiometer
* regulates duty cycle
* and frequency
* 100k potentiometers
* regulate indivitual
* step's heights
* 1k trimming potentiometer
* allows for manual adjustment
* of the frequency to achieve
* a perfect 1V/Octave pitch
* 100k potentiometers
* Allow for adjustment of
* each signal's individual
* contribution to the output
* 20k potentiometer
* Allows for manual
* adjustment of the clipping
* The CD4017B chip is powered via VDD
* 100k potentiometers
* regulate the contributions
* each individual input
* A typical VCO has three
* inputs: KEY, TUNE, LFO
* Timer
* Counter
* VCO
* These transistors are
* thermally bound togather
* (They need to be as close as
* possible in the real build)
* These transistors are
* thermally bound togather
* (They need to be as close as
* possible in the real build)
* 100k potentiometer
* Allows for manual adjustment
* of the amplification
* inverted out
* normal out
* clipped out
* Mixer
* VCA in
* VCA out
* CV in
* KEY
* TUNE
* LFO
* input 1
* input 2
* input 3
* pulse out
* folded out
* input
* 100k potentiometer
* allows for adjusting
* the amplitude of
* input signal
* Wavefolders
.lib ADI.lib
.lib NE555.sub
.lib CD4000_v.lib
.lib UniversalOpamps2.sub
.lib ADI1.lib
.backanno
.end